// Quartus schematic ShiftLeft_Quotient2.bdf as structural Verilog: 48 symbols, 2 pins
module ShiftLeft_Quotient2 (
  input  [47:0] DataIn,
  output [47:0] DataOut
);

  wire SL_Quotient_0_data47, SL_Quotient_1_data47, SL_Quotient_2_data47, SL_Quotient_3_data47,
       SL_Quotient_4_data47, SL_Quotient_5_data47, SL_Quotient_6_data47, SL_Quotient_7_data47,
       SL_Quotient_8_data47, SL_Quotient_9_data47, SL_Quotient_10_data47, SL_Quotient_11_data47,
       SL_Quotient_12_data47, SL_Quotient_13_data47, SL_Quotient_14_data47, SL_Quotient_15_data47,
       SL_Quotient_16_data47, SL_Quotient_17_data47, SL_Quotient_18_data47, SL_Quotient_19_data47,
       SL_Quotient_20_data47, SL_Quotient_21_data47, SL_Quotient_22_data47, SL_Quotient_23_data47,
       SL_Quotient_24_data47, SL_Quotient_25_data47, SL_Quotient_26_data47, SL_Quotient_27_data47,
       SL_Quotient_28_data47, SL_Quotient_29_data47, SL_Quotient_30_data47, SL_Quotient_31_data47,
       SL_Quotient_32_data47, SL_Quotient_33_data47, SL_Quotient_34_data47, SL_Quotient_35_data47,
       SL_Quotient_36_data47, SL_Quotient_37_data47, SL_Quotient_38_data47, SL_Quotient_39_data47,
       SL_Quotient_40_data47, SL_Quotient_41_data47, SL_Quotient_42_data47, SL_Quotient_43_data47,
       SL_Quotient_44_data47, SL_Quotient_45_data47, SL_Quotient_46_data47;
  wire [47:0] SL_Quotient_0_dataout, SL_Quotient_1_dataout, SL_Quotient_2_dataout, SL_Quotient_3_dataout,
       SL_Quotient_4_dataout, SL_Quotient_5_dataout, SL_Quotient_6_dataout, SL_Quotient_7_dataout,
       SL_Quotient_8_dataout, SL_Quotient_9_dataout, SL_Quotient_10_dataout, SL_Quotient_11_dataout,
       SL_Quotient_12_dataout, SL_Quotient_13_dataout, SL_Quotient_14_dataout, SL_Quotient_15_dataout,
       SL_Quotient_16_dataout, SL_Quotient_17_dataout, SL_Quotient_18_dataout, SL_Quotient_19_dataout,
       SL_Quotient_20_dataout, SL_Quotient_21_dataout, SL_Quotient_22_dataout, SL_Quotient_23_dataout,
       SL_Quotient_24_dataout, SL_Quotient_25_dataout, SL_Quotient_26_dataout, SL_Quotient_27_dataout,
       SL_Quotient_28_dataout, SL_Quotient_29_dataout, SL_Quotient_30_dataout, SL_Quotient_31_dataout,
       SL_Quotient_32_dataout, SL_Quotient_33_dataout, SL_Quotient_34_dataout, SL_Quotient_35_dataout,
       SL_Quotient_36_dataout, SL_Quotient_37_dataout, SL_Quotient_38_dataout, SL_Quotient_39_dataout,
       SL_Quotient_40_dataout, SL_Quotient_41_dataout, SL_Quotient_42_dataout, SL_Quotient_43_dataout,
       SL_Quotient_44_dataout, SL_Quotient_45_dataout, SL_Quotient_46_dataout;

  ShiftLeft_Quotient SL_Quotient_0 (
    .DataIn(DataIn), .S(DataIn[47]), .DataOut(SL_Quotient_0_dataout), .Data47(SL_Quotient_0_data47));
  ShiftLeft_Quotient SL_Quotient_1 (
    .DataIn(SL_Quotient_0_dataout), .S(SL_Quotient_0_data47), .DataOut(SL_Quotient_1_dataout),
    .Data47(SL_Quotient_1_data47));
  ShiftLeft_Quotient SL_Quotient_2 (
    .DataIn(SL_Quotient_1_dataout), .S(SL_Quotient_1_data47), .DataOut(SL_Quotient_2_dataout),
    .Data47(SL_Quotient_2_data47));
  ShiftLeft_Quotient SL_Quotient_3 (
    .DataIn(SL_Quotient_2_dataout), .S(SL_Quotient_2_data47), .DataOut(SL_Quotient_3_dataout),
    .Data47(SL_Quotient_3_data47));
  ShiftLeft_Quotient SL_Quotient_4 (
    .DataIn(SL_Quotient_3_dataout), .S(SL_Quotient_3_data47), .DataOut(SL_Quotient_4_dataout),
    .Data47(SL_Quotient_4_data47));
  ShiftLeft_Quotient SL_Quotient_5 (
    .DataIn(SL_Quotient_4_dataout), .S(SL_Quotient_4_data47), .DataOut(SL_Quotient_5_dataout),
    .Data47(SL_Quotient_5_data47));
  ShiftLeft_Quotient SL_Quotient_6 (
    .DataIn(SL_Quotient_5_dataout), .S(SL_Quotient_5_data47), .DataOut(SL_Quotient_6_dataout),
    .Data47(SL_Quotient_6_data47));
  ShiftLeft_Quotient SL_Quotient_7 (
    .DataIn(SL_Quotient_6_dataout), .S(SL_Quotient_6_data47), .DataOut(SL_Quotient_7_dataout),
    .Data47(SL_Quotient_7_data47));
  ShiftLeft_Quotient SL_Quotient_8 (
    .DataIn(SL_Quotient_7_dataout), .S(SL_Quotient_7_data47), .DataOut(SL_Quotient_8_dataout),
    .Data47(SL_Quotient_8_data47));
  ShiftLeft_Quotient SL_Quotient_9 (
    .DataIn(SL_Quotient_8_dataout), .S(SL_Quotient_8_data47), .DataOut(SL_Quotient_9_dataout),
    .Data47(SL_Quotient_9_data47));
  ShiftLeft_Quotient SL_Quotient_10 (
    .DataIn(SL_Quotient_9_dataout), .S(SL_Quotient_9_data47), .DataOut(SL_Quotient_10_dataout),
    .Data47(SL_Quotient_10_data47));
  ShiftLeft_Quotient SL_Quotient_11 (
    .DataIn(SL_Quotient_10_dataout), .S(SL_Quotient_10_data47), .DataOut(SL_Quotient_11_dataout),
    .Data47(SL_Quotient_11_data47));
  ShiftLeft_Quotient SL_Quotient_12 (
    .DataIn(SL_Quotient_11_dataout), .S(SL_Quotient_11_data47), .DataOut(SL_Quotient_12_dataout),
    .Data47(SL_Quotient_12_data47));
  ShiftLeft_Quotient SL_Quotient_13 (
    .DataIn(SL_Quotient_12_dataout), .S(SL_Quotient_12_data47), .DataOut(SL_Quotient_13_dataout),
    .Data47(SL_Quotient_13_data47));
  ShiftLeft_Quotient SL_Quotient_14 (
    .DataIn(SL_Quotient_13_dataout), .S(SL_Quotient_13_data47), .DataOut(SL_Quotient_14_dataout),
    .Data47(SL_Quotient_14_data47));
  ShiftLeft_Quotient SL_Quotient_15 (
    .DataIn(SL_Quotient_14_dataout), .S(SL_Quotient_14_data47), .DataOut(SL_Quotient_15_dataout),
    .Data47(SL_Quotient_15_data47));
  ShiftLeft_Quotient SL_Quotient_16 (
    .DataIn(SL_Quotient_15_dataout), .S(SL_Quotient_15_data47), .DataOut(SL_Quotient_16_dataout),
    .Data47(SL_Quotient_16_data47));
  ShiftLeft_Quotient SL_Quotient_17 (
    .DataIn(SL_Quotient_16_dataout), .S(SL_Quotient_16_data47), .DataOut(SL_Quotient_17_dataout),
    .Data47(SL_Quotient_17_data47));
  ShiftLeft_Quotient SL_Quotient_18 (
    .DataIn(SL_Quotient_17_dataout), .S(SL_Quotient_17_data47), .DataOut(SL_Quotient_18_dataout),
    .Data47(SL_Quotient_18_data47));
  ShiftLeft_Quotient SL_Quotient_19 (
    .DataIn(SL_Quotient_18_dataout), .S(SL_Quotient_18_data47), .DataOut(SL_Quotient_19_dataout),
    .Data47(SL_Quotient_19_data47));
  ShiftLeft_Quotient SL_Quotient_20 (
    .DataIn(SL_Quotient_19_dataout), .S(SL_Quotient_19_data47), .DataOut(SL_Quotient_20_dataout),
    .Data47(SL_Quotient_20_data47));
  ShiftLeft_Quotient SL_Quotient_21 (
    .DataIn(SL_Quotient_20_dataout), .S(SL_Quotient_20_data47), .DataOut(SL_Quotient_21_dataout),
    .Data47(SL_Quotient_21_data47));
  ShiftLeft_Quotient SL_Quotient_22 (
    .DataIn(SL_Quotient_21_dataout), .S(SL_Quotient_21_data47), .DataOut(SL_Quotient_22_dataout),
    .Data47(SL_Quotient_22_data47));
  ShiftLeft_Quotient SL_Quotient_23 (
    .DataIn(SL_Quotient_22_dataout), .S(SL_Quotient_22_data47), .DataOut(SL_Quotient_23_dataout),
    .Data47(SL_Quotient_23_data47));
  ShiftLeft_Quotient SL_Quotient_24 (
    .DataIn(SL_Quotient_23_dataout), .S(SL_Quotient_23_data47), .DataOut(SL_Quotient_24_dataout),
    .Data47(SL_Quotient_24_data47));
  ShiftLeft_Quotient SL_Quotient_25 (
    .DataIn(SL_Quotient_24_dataout), .S(SL_Quotient_24_data47), .DataOut(SL_Quotient_25_dataout),
    .Data47(SL_Quotient_25_data47));
  ShiftLeft_Quotient SL_Quotient_26 (
    .DataIn(SL_Quotient_25_dataout), .S(SL_Quotient_25_data47), .DataOut(SL_Quotient_26_dataout),
    .Data47(SL_Quotient_26_data47));
  ShiftLeft_Quotient SL_Quotient_27 (
    .DataIn(SL_Quotient_26_dataout), .S(SL_Quotient_26_data47), .DataOut(SL_Quotient_27_dataout),
    .Data47(SL_Quotient_27_data47));
  ShiftLeft_Quotient SL_Quotient_28 (
    .DataIn(SL_Quotient_27_dataout), .S(SL_Quotient_27_data47), .DataOut(SL_Quotient_28_dataout),
    .Data47(SL_Quotient_28_data47));
  ShiftLeft_Quotient SL_Quotient_29 (
    .DataIn(SL_Quotient_28_dataout), .S(SL_Quotient_28_data47), .DataOut(SL_Quotient_29_dataout),
    .Data47(SL_Quotient_29_data47));
  ShiftLeft_Quotient SL_Quotient_30 (
    .DataIn(SL_Quotient_29_dataout), .S(SL_Quotient_29_data47), .DataOut(SL_Quotient_30_dataout),
    .Data47(SL_Quotient_30_data47));
  ShiftLeft_Quotient SL_Quotient_31 (
    .DataIn(SL_Quotient_30_dataout), .S(SL_Quotient_30_data47), .DataOut(SL_Quotient_31_dataout),
    .Data47(SL_Quotient_31_data47));
  ShiftLeft_Quotient SL_Quotient_32 (
    .DataIn(SL_Quotient_31_dataout), .S(SL_Quotient_31_data47), .DataOut(SL_Quotient_32_dataout),
    .Data47(SL_Quotient_32_data47));
  ShiftLeft_Quotient SL_Quotient_33 (
    .DataIn(SL_Quotient_32_dataout), .S(SL_Quotient_32_data47), .DataOut(SL_Quotient_33_dataout),
    .Data47(SL_Quotient_33_data47));
  ShiftLeft_Quotient SL_Quotient_34 (
    .DataIn(SL_Quotient_33_dataout), .S(SL_Quotient_33_data47), .DataOut(SL_Quotient_34_dataout),
    .Data47(SL_Quotient_34_data47));
  ShiftLeft_Quotient SL_Quotient_35 (
    .DataIn(SL_Quotient_34_dataout), .S(SL_Quotient_34_data47), .DataOut(SL_Quotient_35_dataout),
    .Data47(SL_Quotient_35_data47));
  ShiftLeft_Quotient SL_Quotient_36 (
    .DataIn(SL_Quotient_35_dataout), .S(SL_Quotient_35_data47), .DataOut(SL_Quotient_36_dataout),
    .Data47(SL_Quotient_36_data47));
  ShiftLeft_Quotient SL_Quotient_37 (
    .DataIn(SL_Quotient_36_dataout), .S(SL_Quotient_36_data47), .DataOut(SL_Quotient_37_dataout),
    .Data47(SL_Quotient_37_data47));
  ShiftLeft_Quotient SL_Quotient_38 (
    .DataIn(SL_Quotient_37_dataout), .S(SL_Quotient_37_data47), .DataOut(SL_Quotient_38_dataout),
    .Data47(SL_Quotient_38_data47));
  ShiftLeft_Quotient SL_Quotient_39 (
    .DataIn(SL_Quotient_38_dataout), .S(SL_Quotient_38_data47), .DataOut(SL_Quotient_39_dataout),
    .Data47(SL_Quotient_39_data47));
  ShiftLeft_Quotient SL_Quotient_40 (
    .DataIn(SL_Quotient_39_dataout), .S(SL_Quotient_39_data47), .DataOut(SL_Quotient_40_dataout),
    .Data47(SL_Quotient_40_data47));
  ShiftLeft_Quotient SL_Quotient_41 (
    .DataIn(SL_Quotient_40_dataout), .S(SL_Quotient_40_data47), .DataOut(SL_Quotient_41_dataout),
    .Data47(SL_Quotient_41_data47));
  ShiftLeft_Quotient SL_Quotient_42 (
    .DataIn(SL_Quotient_41_dataout), .S(SL_Quotient_41_data47), .DataOut(SL_Quotient_42_dataout),
    .Data47(SL_Quotient_42_data47));
  ShiftLeft_Quotient SL_Quotient_43 (
    .DataIn(SL_Quotient_42_dataout), .S(SL_Quotient_42_data47), .DataOut(SL_Quotient_43_dataout),
    .Data47(SL_Quotient_43_data47));
  ShiftLeft_Quotient SL_Quotient_44 (
    .DataIn(SL_Quotient_43_dataout), .S(SL_Quotient_43_data47), .DataOut(SL_Quotient_44_dataout),
    .Data47(SL_Quotient_44_data47));
  ShiftLeft_Quotient SL_Quotient_45 (
    .DataIn(SL_Quotient_44_dataout), .S(SL_Quotient_44_data47), .DataOut(SL_Quotient_45_dataout),
    .Data47(SL_Quotient_45_data47));
  ShiftLeft_Quotient SL_Quotient_46 (
    .DataIn(SL_Quotient_45_dataout), .S(SL_Quotient_45_data47), .DataOut(SL_Quotient_46_dataout),
    .Data47(SL_Quotient_46_data47));
  ShiftLeft_Quotient SL_Quotient_47 (
    .DataIn(SL_Quotient_46_dataout), .S(SL_Quotient_46_data47), .DataOut(DataOut));  // open: Data47
endmodule
